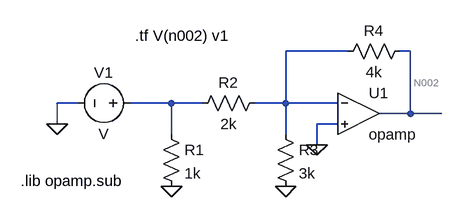
[diagram p0: schematic pag6es3.asc]
pag6es3.asc, the LTspice schematic file:
Version 4
SHEET 1 880 680
WIRE 240 64 144 64
WIRE 336 64 320 64
WIRE -176 144 -208 144
WIRE -32 144 -96 144
WIRE 16 144 -32 144
WIRE 144 144 144 64
WIRE 144 144 96 144
WIRE 224 144 144 144
WIRE 336 160 336 64
WIRE 336 160 288 160
WIRE 384 160 336 160
WIRE -208 176 -208 144
WIRE 224 176 192 176
WIRE -32 192 -32 144
WIRE 144 192 144 144
WIRE 192 208 192 176
FLAG 192 208 0
FLAG -32 272 0
FLAG 144 272 0
FLAG -208 176 0
SYMBOL OpAmps\\opamp 256 96 R0
SYMATTR InstName U1
SYMBOL res 336 48 R90
WINDOW 0 0 56 VBottom 2
WINDOW 3 32 56 VTop 2
SYMATTR InstName R4
SYMATTR Value 4k
SYMBOL res 128 176 R0
WINDOW 0 52 40 Center 2
SYMATTR InstName R3
SYMATTR Value 3k
SYMBOL res 112 128 R90
WINDOW 0 0 56 VBottom 2
WINDOW 3 32 56 VTop 2
SYMATTR InstName R2
SYMATTR Value 2k
SYMBOL res -48 176 R0
SYMATTR InstName R1
SYMATTR Value 1k
SYMBOL voltage -80 144 R90
WINDOW 0 -32 56 VBottom 2
WINDOW 3 32 56 VTop 2
SYMATTR InstName V1
TEXT -88 40 Left 2 !.tf V(n002) v1
TEXT -264 264 Left 2 !.lib opamp.sub

The netlist it stands for:
* pag6es3.asc
XU1 N001 0 N002 opamp Aol=100K GBW=10Meg  ; pins invin noninvin out
R4 N002 N001 4k
R3 N001 0 3k
R2 N001 N003 2k
R1 N003 0 1k
V1 N003 0 V
.tf V(n002) v1
.lib opamp.sub
.backanno
.end